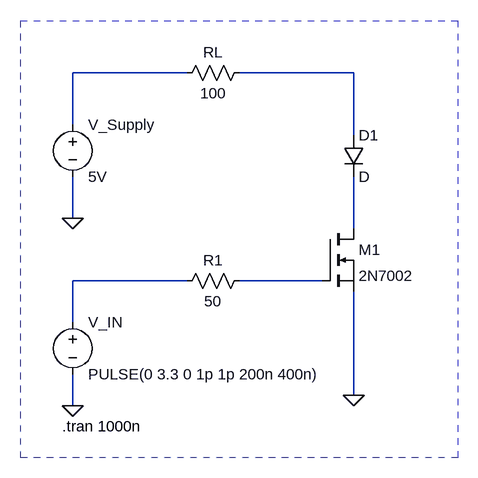
[diagram p0: schematic Transmitter v1.asc]
Transmitter v1.asc, the LTspice schematic file:
Version 4
SHEET 1 880 680
WIRE 32 -112 -144 -112
WIRE 288 -112 112 -112
WIRE -144 -32 -144 -112
WIRE 288 -16 288 -112
WIRE -144 112 -144 48
WIRE 288 128 288 48
WIRE 32 208 -144 208
WIRE 240 208 112 208
WIRE -144 272 -144 208
WIRE 288 384 288 224
WIRE -144 400 -144 352
FLAG 288 384 0
FLAG -144 400 0
FLAG -144 112 0
SYMBOL nmos 240 128 R0
SYMATTR InstName M1
SYMATTR Value 2N7002
SYMBOL res 128 -128 R90
WINDOW 0 0 56 VBottom 2
WINDOW 3 32 56 VTop 2
SYMATTR InstName RL
SYMATTR Value 100
SYMBOL res 128 192 R90
WINDOW 0 0 56 VBottom 2
WINDOW 3 32 56 VTop 2
SYMATTR InstName R1
SYMATTR Value 50
SYMBOL voltage -144 256 R0
WINDOW 123 0 0 Left 0
WINDOW 39 0 0 Left 0
SYMATTR InstName V_IN
SYMATTR Value PULSE(0 3.3 0 1p 1p 200n 400n)
SYMBOL voltage -144 -48 R0
WINDOW 123 0 0 Left 0
WINDOW 39 0 0 Left 0
SYMATTR InstName V_Supply
SYMATTR Value 5V
SYMBOL diode 272 -16 R0
SYMATTR InstName D1
TEXT -160 432 Left 2 !.tran 1000n
RECTANGLE Normal 448 480 -224 -192 2

The netlist it stands for:
* Transmitter v1.asc
M1 N003 N005 0 0 2N7002
RL N002 N001 100
R1 N005 N004 50
V_IN N004 0 PULSE(0 3.3 0 1p 1p 200n 400n)
V_Supply N001 0 5V
D1 N002 N003 D
.model D D
.lib standard.dio
.model NMOS NMOS
.model PMOS PMOS
.lib standard.mos
.tran 1000n
.backanno
.end